# Altium schematic sheet SideSense.SchDoc
size A4; SheetNumber: 5; SheetTotal: 6
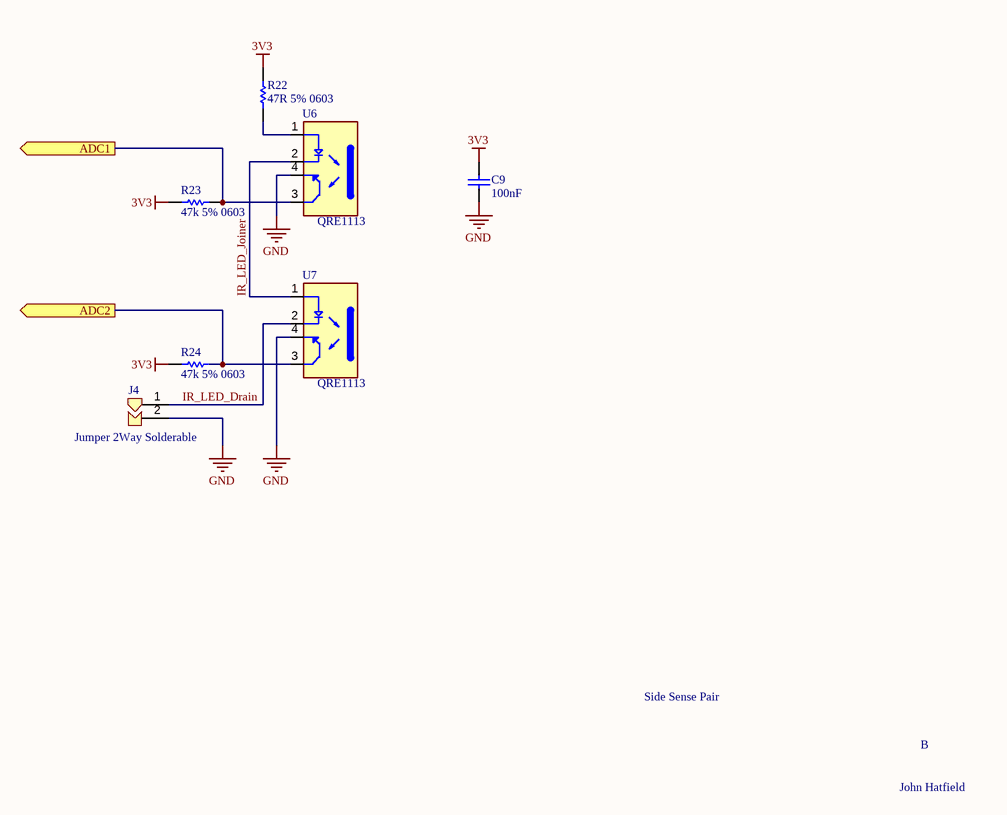
[diagram p0: SideSense.SchDoc]

## Parts
C9  100nF  [Cap_Ceramic_0603]
J4  Jumper 2Way Solderable  [Jumper_2Way_Solderable]
R22  47R 5% 0603  [Res_ThinFilm_0603]
R23  47k 5% 0603  [Res_ThinFilm_0603]
R24  47k 5% 0603  [Res_ThinFilm_0603]
U6  QRE1113  [DIP400W50P180L360H200Q4]
U7  QRE1113  [DIP400W50P180L360H200Q4]

## Ports
ADC1 (out), ADC2 (out)

## Nets
3V3: C9.2 R22.2 R23.1 R24.1
GND: C9.1 J4.2 U6.4(ET) U7.4(ET)
ADC1: R23.2 U6.3(CT) ; port ADC1
ADC2: R24.2 U7.3(CT) ; port ADC2
IR_LED_Drain: J4.1 U7.2(C)
IR_LED_Joiner: U6.2(C) U7.1(A)
NetR22_1: R22.1 U6.1(A)

## Notes on the sheet
- Side Sense Pair
- B
- John Hatfield

## Library data of the parts
C9 = 100nF 50V 5% X7R 0603: Capacitor, Ceramic, SMD, 100nF, 50V, 5%, X7R, 0603
J4 = Jumper 2Way Side Solderable
R22 = 47R 5% 0603: Resistor, SMD, 47R, 0.1W, 5%, 0603
R23 R24 = 47k 5% 0603: Resistor, SMD, 47k, 0.1W, 5%, 0603
U6 U7 = QRE1113: Reflective Optical Sensor 0.197 _5mm_ 4-DIP _0.157, 4.00mm_; MF: ON Semiconductor; Availability: Unavailable; Package: DIP-4 ON Semiconductor; MP: QRE1113; Value: *; SnapEDA_Link: https://www.snapeda.com/parts/QRE1113/ON%20Semiconductor/view-part/2391104/?ref=snap; Price: None